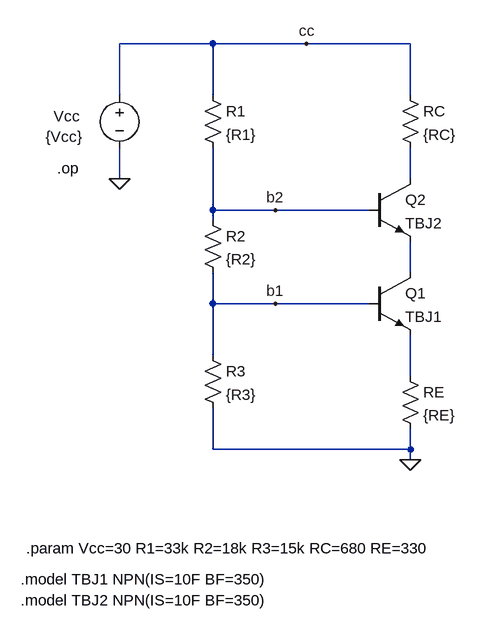
[diagram p0: schematic COMB03op.asc]
COMB03op.asc, the LTspice schematic file:
Version 4
SHEET 1 1608 1076
WIRE 880 -144 736 -144
WIRE 1024 -144 880 -144
WIRE 1184 -144 1024 -144
WIRE 736 -64 736 -144
WIRE 880 -64 880 -144
WIRE 1184 -64 1184 -144
WIRE 736 64 736 16
WIRE 1184 64 1184 16
WIRE 880 112 880 16
WIRE 976 112 880 112
WIRE 1120 112 976 112
WIRE 880 128 880 112
WIRE 1184 208 1184 160
WIRE 880 256 880 208
WIRE 976 256 880 256
WIRE 1120 256 976 256
WIRE 880 336 880 256
WIRE 1184 368 1184 304
WIRE 880 480 880 416
WIRE 1184 480 1184 448
WIRE 1184 480 880 480
WIRE 1184 496 1184 480
FLAG 1184 496 0
FLAG 736 64 0
FLAG 1024 -144 cc
FLAG 976 256 b1
FLAG 976 112 b2
SYMBOL res 1168 -80 R0
SYMATTR InstName RC
SYMATTR Value {RC}
SYMBOL voltage 736 -80 R0
WINDOW 123 0 0 Left 0
WINDOW 39 0 0 Left 0
WINDOW 0 -101 48 Left 2
WINDOW 3 -114 79 Left 2
SYMATTR InstName Vcc
SYMATTR Value {Vcc}
SYMBOL npn 1120 208 R0
SYMATTR InstName Q1
SYMATTR Value TBJ1
SYMBOL res 1168 352 R0
SYMATTR InstName RE
SYMATTR Value {RE}
SYMBOL res 864 -80 R0
SYMATTR InstName R1
SYMATTR Value {R1}
SYMBOL res 864 112 R0
SYMATTR InstName R2
SYMATTR Value {R2}
SYMBOL npn 1120 64 R0
SYMATTR InstName Q2
SYMATTR Value TBJ2
SYMBOL res 864 320 R0
SYMATTR InstName R3
SYMATTR Value {R3}
TEXT 640 48 Left 2 !.op
TEXT 592 632 Left 2 !.param Vcc=30 R1=33k R2=18k R3=15k RC=680 RE=330
TEXT 584 680 Left 2 !.model TBJ1 NPN(IS=10F BF=350)
TEXT 584 712 Left 2 !.model TBJ2 NPN(IS=10F BF=350)

The netlist it stands for:
* COMB03op.asc
RC cc N001 {RC}
Vcc cc 0 {Vcc}
Q1 N002 b1 N003 0 TBJ1
RE N003 0 {RE}
R1 cc b2 {R1}
R2 b2 b1 {R2}
Q2 N001 b2 N002 0 TBJ2
R3 b1 0 {R3}
.model NPN NPN
.model PNP PNP
.lib standard.bjt
.op
.param Vcc=30 R1=33k R2=18k R3=15k RC=680 RE=330
.model TBJ1 NPN(IS=10F BF=350)
.model TBJ2 NPN(IS=10F BF=350)
.backanno
.end